# EAGLE design DDS Based Control Board (EAGLE 8.0.1)
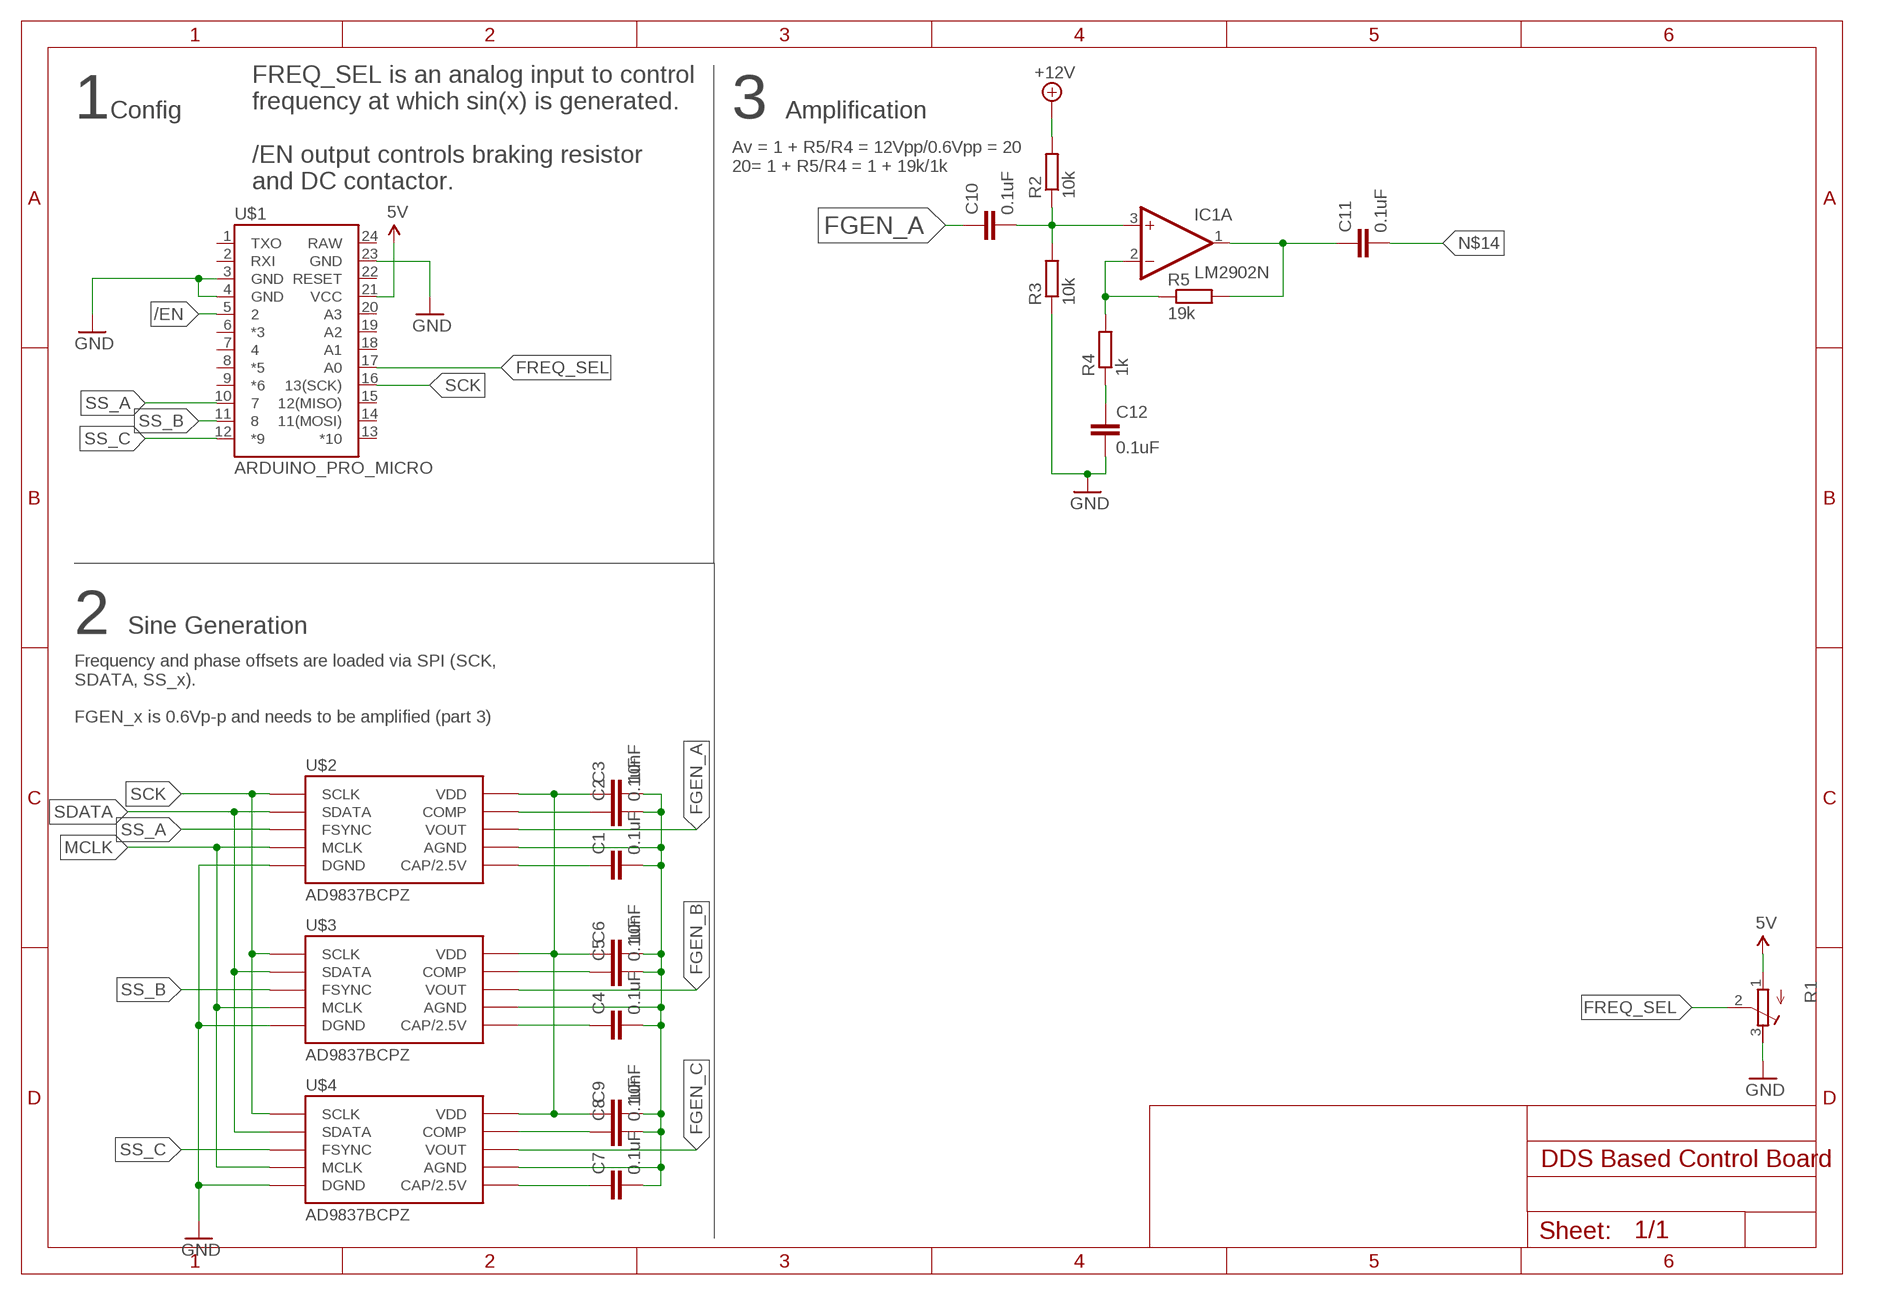
[diagram p0: schematic, sheet 1]
FRAME1 (A4L-LOC): REVISION: 1

## Parts
C1  0.1uF  C-EU025-025X050  [C025-025X050]
C2  0.1uF  C-EU025-025X050  [C025-025X050]
C3  10nF  C-EU025-025X050  [C025-025X050]
C4  0.1uF  C-EU025-025X050  [C025-025X050]
C5  0.1uF  C-EU025-025X050  [C025-025X050]
C6  10nF  C-EU025-025X050  [C025-025X050]
C7  0.1uF  C-EU025-025X050  [C025-025X050]
C8  0.1uF  C-EU025-025X050  [C025-025X050]
C9  10nF  C-EU025-025X050  [C025-025X050]
C10  0.1uF  C-EU025-025X050  [C025-025X050]
C11  0.1uF  C-EU025-025X050  [C025-025X050]
C12  0.1uF  C-EU025-025X050  [C025-025X050]
IC1  LM2902N  [DIL14]
R1  R-TRIMM64X  [RTRIM64X]
R2  10k  R-EU_0207/7  [0207/7]
R3  10k  R-EU_0207/7  [0207/7]
R4  1k  R-EU_0207/7  [0207/7]
R5  19k  R-EU_0207/7  [0207/7]
U$1  ARDUINO_PRO_MICRO  [ARDUINO_PRO_MICRO]
U$2  AD9837BCPZ  AD9837  [AD9837]
U$3  AD9837BCPZ  AD9837  [AD9837]
U$4  AD9837BCPZ  AD9837  [AD9837]

## Nets
5V: R1.1(A)
+12V: R2.2
/EN: U$1.5
FGEN_A: C10.1 U$2.P$10(VOUT)
FGEN_B: U$3.P$10(VOUT)
FGEN_C: U$4.P$10(VOUT)
FREQ_SEL: R1.2(S) U$1.17(A0)
GND: C12.2 R1.3(E) R3.1 U$1.3(GND) U$1.4(GND) U$1.23(GND)
MCLK: U$2.P$5(MCLK) U$3.P$5(MCLK) U$4.P$5(MCLK)
N$1: C3.1 C6.1 C9.1 U$2.P$2(VDD) U$3.P$2(VDD) U$4.P$2(VDD)
N$2: C1.2 C2.2 C3.2 C4.2 C5.2 C6.2 C7.2 C8.2 C9.2 U$2.P$9(AGND) U$3.P$9(AGND) U$4.P$9(AGND)
N$3: C1.1 U$2.P$3(CAP/2.5V)
N$4: U$2.P$0(DGND) U$2.P$4(DGND) U$3.P$0(DGND) U$3.P$4(DGND) U$4.P$0(DGND) U$4.P$4(DGND) ; supply symbol labelled GND
N$5: C2.1 U$2.P$1(COMP)
N$6: C5.1 U$3.P$1(COMP)
N$7: C8.1 U$4.P$1(COMP)
N$8: C7.1 U$4.P$3(CAP/2.5V)
N$9: C4.1 U$3.P$3(CAP/2.5V)
N$10: C10.2 IC1.3(A:+IN) R2.1 R3.2
N$11: C11.1 IC1.1(A:OUT) R5.2
N$12: IC1.2(A:-IN) R4.2 R5.1
N$13: C12.1 R4.1
N$14: C11.2
SCK: U$1.16(13(SCK)) U$2.P$7(SCLK) U$3.P$7(SCLK) U$4.P$7(SCLK)
SDATA: U$2.P$6(SDATA) U$3.P$6(SDATA) U$4.P$6(SDATA)
SS_A: U$1.10 U$2.P$8(FSYNC)
SS_B: U$1.11 U$3.P$8(FSYNC)
SS_C: U$1.12(*9) U$4.P$8(FSYNC)
VCC: U$1.21(VCC) ; supply symbol labelled 5V
Unconnected: IC1.5(B:+IN) IC1.6(B:-IN) IC1.7(B:OUT) IC1.8(C:OUT) IC1.9(C:-IN) IC1.10(C:+IN) IC1.12(D:+IN) IC1.13(D:-IN) IC1.14(D:OUT) U$1.1(TXO) U$1.2(RXI) U$1.6(*3) U$1.7 U$1.8(*5) U$1.9(*6) U$1.13(*10) U$1.14(11(MOSI)) U$1.15(12(MISO)) U$1.18(A1) U$1.19(A2) U$1.20(A3) U$1.22(RESET) U$1.24(RAW)

## Notes on the sheet
- 1 | Config | 3 | Amplification
- Av = 1 + R5/R4 = 12Vpp/0.6Vpp = 20
  20= 1 + R5/R4 = 1 + 19k/1k
- FREQ_SEL is an analog input to control
  frequency at which sin(x) is generated.
  
  /EN output controls braking resistor
  and DC contactor.
- 2 | Sine Generation
- Frequency and phase offsets are loaded via SPI (SCK,
  SDATA, SS_x).
  
  FGEN_x is 0.6Vp-p and needs to be amplified (part 3)

## Power pins joined to a net without a drawn wire
V+: IC1.4(P:V+)
V-: IC1.11(P:V-)

## Library data of the parts
C1-C12 = rcl:C-EU: CAPACITOR, European symbol
IC1 = linear:LM2902: Low power quad operational amplifier Source: Data sgeet <http://www.st.com/internet/com/TECHNICAL_RESOURCES/TECHNICAL_LITERATURE/DATASHEET/CD00000533.pdf>
R1 = rcl:R-TRIMM: Trimm resistor
R2-R5 = rcl:R-EU_: RESISTOR, European symbol
U$1 = SparkFun-Boards:ARDUINO_PRO_MICRO
U$2-U$4 = SparkFun-IC-Special-Function:AD9837: Programmable waveform generator Sine, triangular, and square wave outputs Datasheet <https://cdn.sparkfun.com/datasheets/BreakoutBoards/AD9837.PDF> SparkFun Products SparkFun MiniGen - Pro Mini Signal Generator Shield <https://www.sparkfun.com/products/11420> (BOB-11420); PROD_ID: IC-11223

## Board
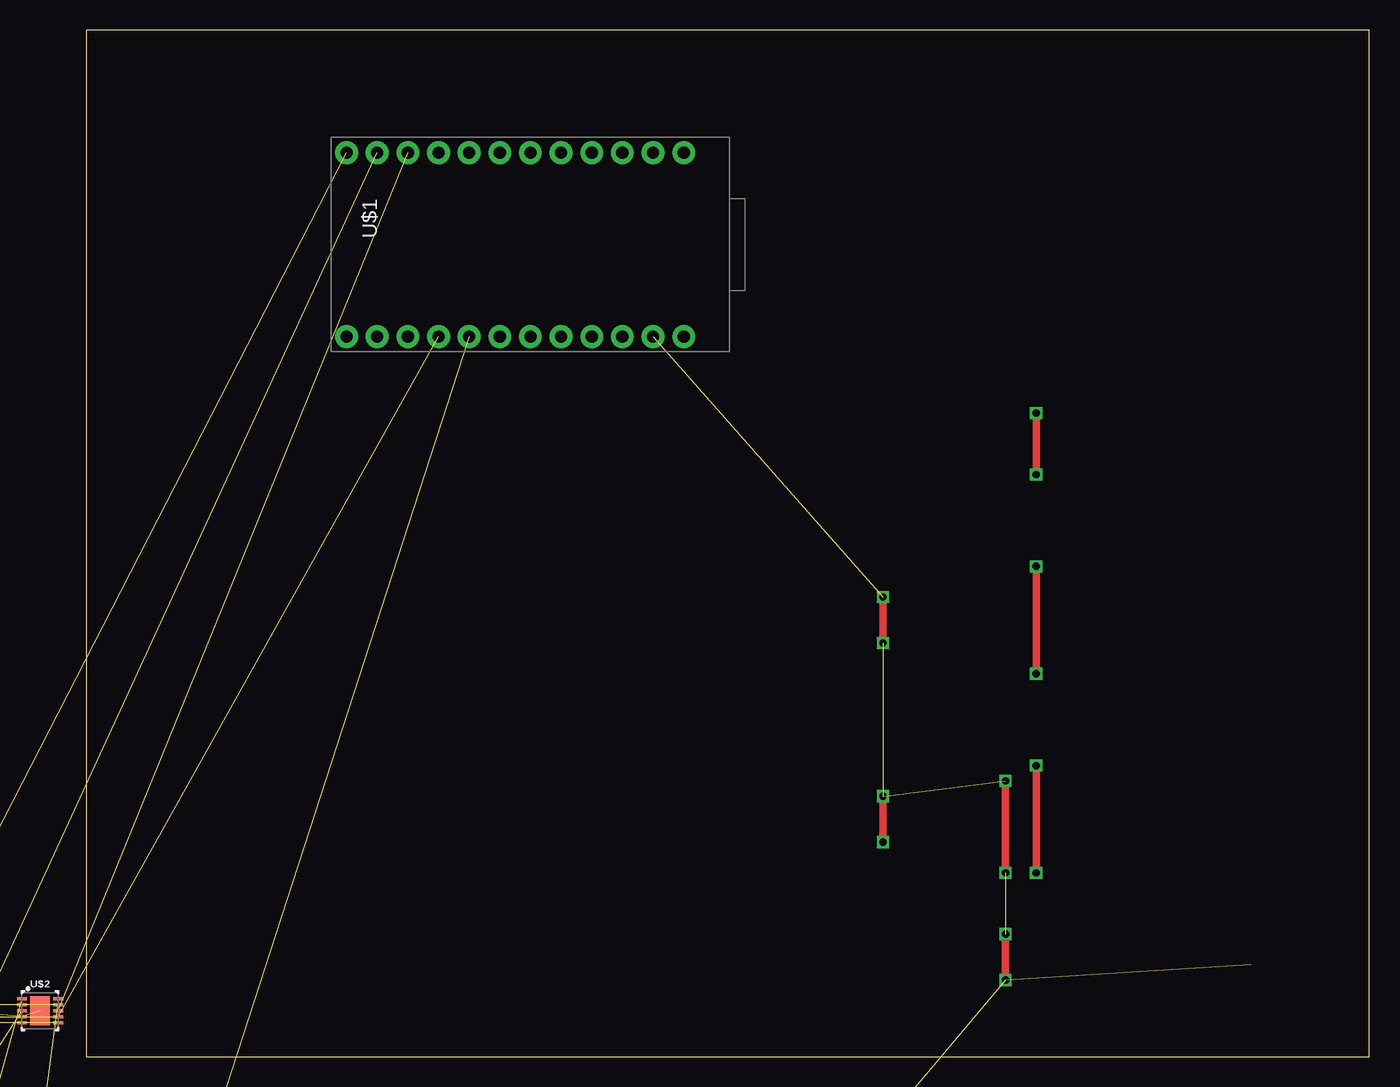
[diagram p1: board, top side]
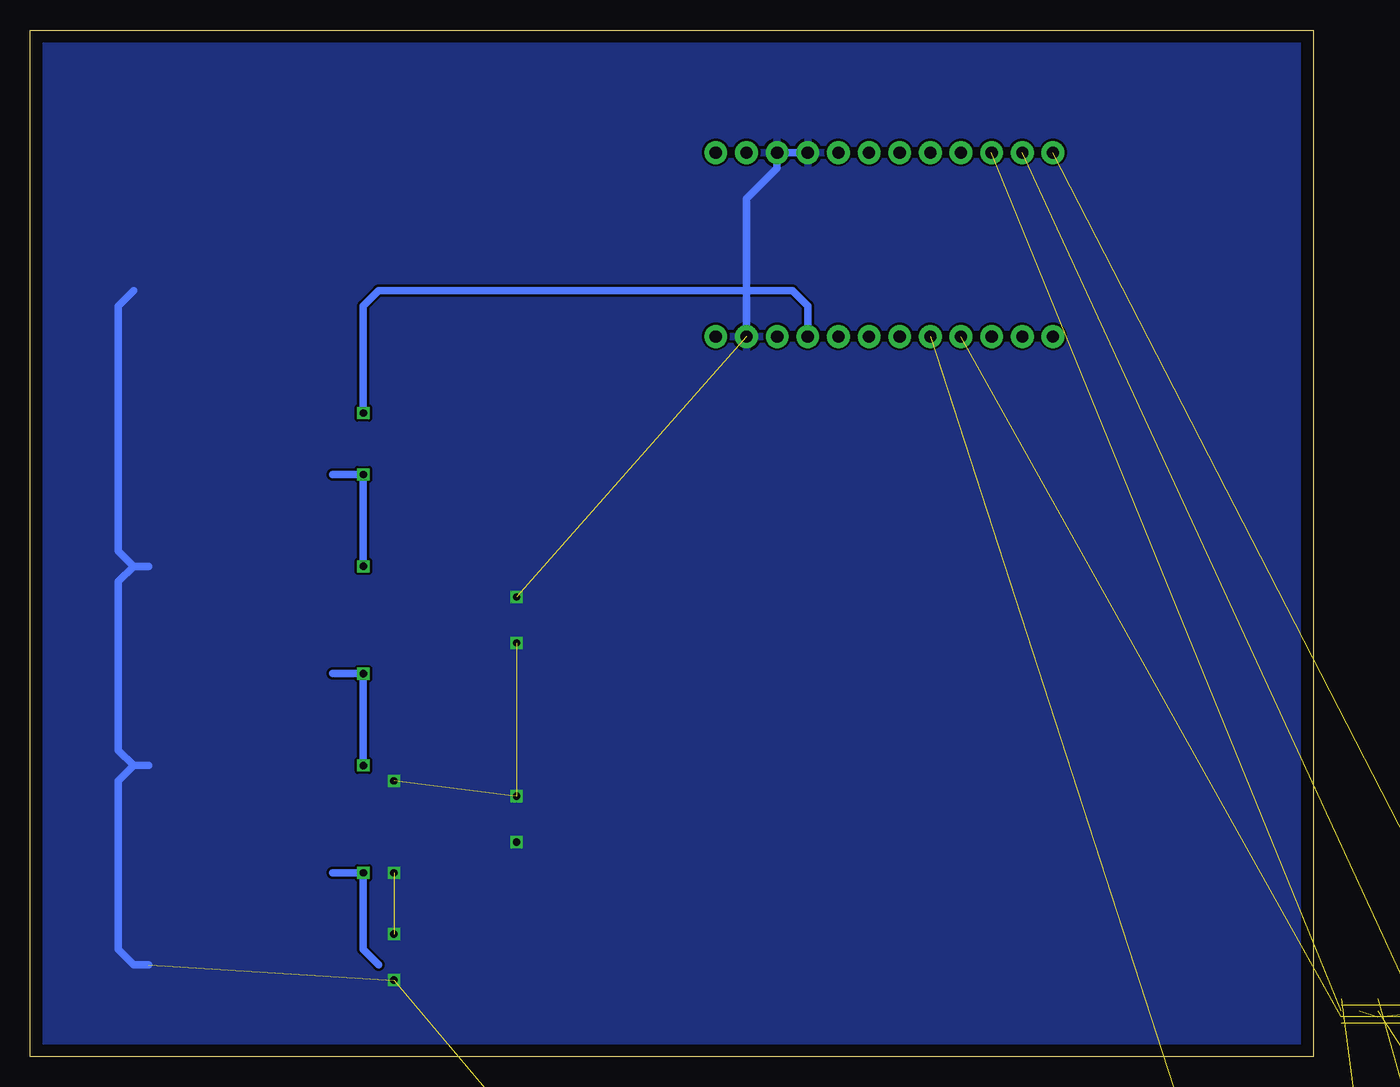
[diagram p2: board, bottom side, seen from below]

Size 106.35 x 85.08 mm. Coordinates in mm from the lower left corner, seen from the top.
Outline: 0,0 106.35,0 106.35,85.08 0,85.08 0,0
Copper layers (1*16): Top 0.035mm / dielectric 1.5mm / Bottom 0.035mm
Design rules "default": minimum track width 10mil, minimum drill 24mil, track to track 8mil, track to pad 8mil, pad to pad 8mil, via to via 8mil, smd to smd 8mil, copper to edge 40mil, drill to drill 8mil, minimum pad ring 10mil, minimum via ring 8mil, stop-mask expansion 4mil, vias tented up to drill 0mil, thermal gap 10mil

### Footprints (pad centres in the part's own frame; a part is rotated, then mirrored left to right if it is on the bottom)
C025-025X050 = drill 0.813 octagon: 1 -1.27,0; 2 1.27,0
DIL14 = drill 0.813 long: 1 -7.62,-3.81; 2 -5.08,-3.81; 3 -2.54,-3.81; 4 0,-3.81; 5 2.54,-3.81; 6 5.08,-3.81; 7 7.62,-3.81; 8 7.62,3.81; 9 5.08,3.81; 10 2.54,3.81; 11 0,3.81; 12 -2.54,3.81; 13 -5.08,3.81; 14 -7.62,3.81
RTRIM64X = drill 0.61: 1 1.27,-2.54; 2 1.27,0; 3 1.27,2.54
0207/7 = drill 0.813 octagon: 1 -3.81,0; 2 3.81,0
ARDUINO_PRO_MICRO = drill 1.016 pad 1.88: 1 -7.62,12.7; 2 -7.62,10.16; 3 -7.62,7.62; 4 -7.62,5.08; 5 -7.62,2.54; 6 -7.62,0; 7 -7.62,-2.54; 8 -7.62,-5.08; 9 -7.62,-7.62; 10 -7.62,-10.16; 11 -7.62,-12.7; 12 -7.62,-15.24; 13 7.62,-15.24; 14 7.62,-12.7; 15 7.62,-10.16; 16 7.62,-7.62; 17 7.62,-5.08; 18 7.62,-2.54; 19 7.62,0; 20 7.62,2.54; 21 7.62,5.08; 22 7.62,7.62; 23 7.62,10.16; 24 7.62,12.7
AD9837 = smd 1.64 x 2.38: P$0 0,0 | smd 0.8 x 0.25: P$1 -1.5,1; P$2 -1.5,0.5; P$3 -1.5,0; P$4 -1.5,-0.5; P$5 -1.5,-1; P$6 1.5,-1; P$7 1.5,-0.5; P$8 1.5,0; P$9 1.5,0.5; P$10 1.5,1

### Placement (x,y rotation side)
C1  -11.43,-7.62 0 top  (outside the outline)
C2  -11.43,-21.59 0 top  (outside the outline)
C3  -11.43,-35.56 0 top  (outside the outline)
C4  -11.43,-49.53 0 top  (outside the outline)
C5  -11.43,-63.5 0 top  (outside the outline)
C6  -11.43,-77.47 0 top  (outside the outline)
C7  -11.43,-91.44 0 top  (outside the outline)
C8  -11.43,-105.41 0 top  (outside the outline)
C9  -11.43,-119.38 0 top  (outside the outline)
C10  -22.86,-161.29 0 top  (outside the outline)
C11  -22.86,-224.79 0 top  (outside the outline)
C12  -22.86,-238.76 0 top  (outside the outline)
IC1  -16.51,-179.07 0 top  (outside the outline)
R1  -26.67,-116.84 0 top  (outside the outline)
R2  -20.32,-133.35 0 top  (outside the outline)
R3  -20.32,-147.32 0 top  (outside the outline)
R4  -20.32,-196.85 0 top  (outside the outline)
R5  -20.32,-210.82 0 top  (outside the outline)
U$1  36.83,67.31 270 top
U$2  -3.81,3.81 0 top
U$3  -10.16,3.81 0 top  (outside the outline)
U$4  -16.51,3.81 0 top  (outside the outline)

### Tracks (layer width: path | path; a pad name or v marks a point on that pad's centre or on a via)
FGEN_A  (1 unrouted)
FREQ_SEL  (1 unrouted)
GND  (via drill 0.6)  (8 unrouted)
  Top 0.61: v66.04,21.59 v66.04,17.78 | v66.04,38.1 v66.04,34.29 | v76.2,15.24 v76.2,22.86 | v76.2,10.16 v76.2,6.35
  Bottom 0.61: 97.79,24.13 99.06,22.86 99.06,8.89 97.79,7.62 96.52,7.62 | 96.52,24.13 97.79,24.13 | 97.79,24.13 99.06,25.4 99.06,39.37 97.79,40.64 | 97.79,40.64 96.52,40.64 | 97.79,63.5 99.06,62.23 99.06,41.91 97.79,40.64 | U$1.4 U$1.3 44.45,73.66 46.99,71.12 U$1.23 46.99,63.5
  pour Bottom: 0,85.09 106.68,85.09 106.68,0 0,0
MCLK  (2 unrouted)
N$1  (5 unrouted)
N$2  (11 unrouted)
N$3  (1 unrouted)
N$4  (5 unrouted)
N$5  (1 unrouted)
N$6  (1 unrouted)
N$7  (1 unrouted)
N$8  (1 unrouted)
N$9  (1 unrouted)
N$10  (3 unrouted)
N$11  (2 unrouted)
N$12  (2 unrouted)
N$13  (1 unrouted)
SCK  (3 unrouted)
SDATA  (2 unrouted)
SS_A  (1 unrouted)
SS_B  (1 unrouted)
SS_C  (1 unrouted)
VCC  (via drill 0.6)
  Top 0.61: v78.74,15.24 v78.74,24.13 | v78.74,40.64 v78.74,31.75 | v78.74,48.26 v78.74,53.34
  Bottom 0.61: 81.28,15.24 v78.74,15.24 78.74,8.89 77.47,7.62 | v78.74,24.13 v78.74,31.75 81.28,31.75 | v78.74,40.64 v78.74,48.26 81.28,48.26 | U$1.21 41.91,62.23 43.18,63.5 77.47,63.5 78.74,62.23 78.74,57.15 v78.74,53.34